# EAGLE schematic vichaarak (EAGLE 9.6.2)
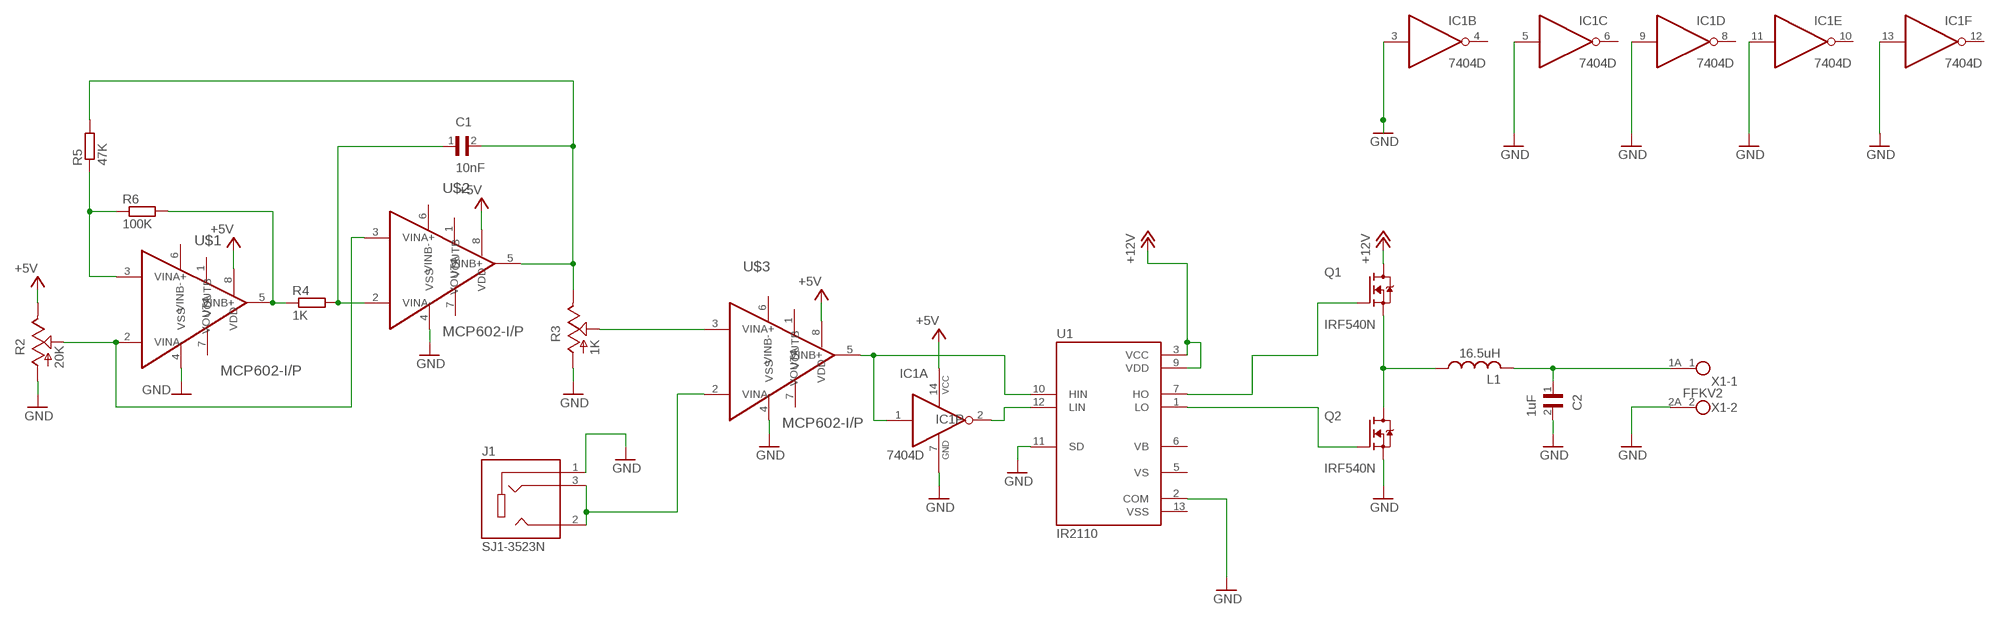
[diagram p0: schematic, sheet 1]

## Parts
C1  10nF  CAPACITOR  [C0603]
C2  1uF  CAPACITOR  [C0603]
IC1  7404D  [SO14]
J1  SJ1-3523N  [CUI_SJ1-3523N]
L1  16.5uH  L-US0204/7  [0204/7]
Q1  IRF540N  [TO254P1054X469X1930-3]
Q2  IRF540N  [TO254P1054X469X1930-3]
R2  20K  TRIM_US-PT10  [PT-10]
R3  1K  TRIM_US-PT10  [PT-10]
R4  1K  RESISTOR  [R0603]
R5  47K  RESISTOR  [R0603]
R6  100K  RESISTOR  [R0603]
U1  IR2110  [DIP762W45P254L2019H533Q14]
U$1  MCP602-I/P  [DIP787W46P254L927H533Q8]
U$2  MCP602-I/P  [DIP787W46P254L927H533Q8]
U$3  MCP602-I/P  [DIP787W46P254L927H533Q8]
X1  FFKV2  [FFKV2]

## Nets
+5V: IC1.14(P:VCC) R2.E U$1.8(VDD) U$2.8(VDD) U$3.8(VDD)
+12V: Q1.2(D) U1.3(VCC) U1.9(VDD)
GND: C2.2 IC1.3(B:I) IC1.5(C:I) IC1.7(P:GND) IC1.9(D:I) IC1.11(E:I) IC1.13(F:I) J1.1 Q2.3(S) R2.A R3.A U1.2(COM) U1.11(SD) U$1.4(VSS) U$2.4(VSS) U$3.4(VSS) X1.2A
N$1: R2.S U$1.2(VINA-) U$2.3(VINA+)
N$2: R5.1 R6.1 U$1.3(VINA+)
N$3: C1.2 R3.E R5.2 U$2.5(VINB+)
N$4: R4.1 R6.2 U$1.5(VINB+)
N$5: C1.1 R4.2 U$2.2(VINA-)
N$7: R3.S U$3.3(VINA+)
N$8: J1.2 J1.3 U$3.2(VINA-)
N$9: IC1.2(A:O) U1.12(LIN)
N$10: IC1.1(A:I) U1.10(HIN) U$3.5(VINB+)
N$11: L1.1 Q1.3(S) Q2.2(D)
N$12: Q1.1(G) U1.7(HO)
N$13: Q2.1(G) U1.1(LO)
N$14: C2.1 L1.2 X1.1A
Unconnected: IC1.4(B:O) IC1.6(C:O) IC1.8(D:O) IC1.10(E:O) IC1.12(F:O) U1.5(VS) U1.6(VB) U$1.1(VOUTA) U$1.6(VINB-) U$1.7(VOUTB) U$2.1(VOUTA) U$2.6(VINB-) U$2.7(VOUTB) U$3.1(VOUTA) U$3.6(VINB-) U$3.7(VOUTB) X1.1 X1.2

## Power pins joined to a net without a drawn wire
VSS: U1.13(VSS)

## Library data of the parts
C1 C2 = PC_Capacitor_0603:CAPACITOR: CAP CERAMIC, 0.1UF, 50V, X7R, 0603, FULL REEL Check prices <https://pricing.snapeda.com/parts/CGA3E2X7R1H104K080AA/TDK/view-part?ref=eda>; AVAILABILITY: Good; DESCRIPTION: 0.1µF ±10% 50V Ceramic Capacitor X7R 0603 (1608 Metric); MF: TDK; MP: CGA3E2X7R1H104K080AA; PACKAGE: 1608 TDK; PRICE: None; PURCHASE-URL: https://pricing.snapeda.com/search/part/CGA3E2X7R1H104K080AA/?ref=eda
IC1 = 74xx-us:74*04: Hex INVERTER
J1 = SJ1-3523N:SJ1-3523N: Check availability <https://pricing.snapeda.com/parts/SJ1-3523N/Same%20Sky/view-part?ref=eda>; AVAILABILITY: In Stock; CHECK_PRICES: https://www.snapeda.com/parts/SJ1-3523N/Same+Sky/view-part/?ref=eda; DESCRIPTION: 3.5 mm, Stereo, Right Angle, Through Hole, 3 Conductors, 0 Internal Switches, Audio Jack Connector; MF: Same Sky; MP: SJ1-3523N; PACKAGE: None; PRICE: None; SNAPEDA_LINK: https://www.snapeda.com/parts/SJ1-3523N/Same+Sky/view-part/?ref=snap
L1 = rcl:L-US: INDUCTOR, American symbol; SPICEPREFIX: L
Q1 Q2 = IRF540N:IRF540N: Check availability <https://pricing.snapeda.com/parts/IRF540N/Infineon%20Technologies/view-part?ref=eda>; AVAILABILITY: In Stock; CHECK_PRICES: https://www.snapeda.com/parts/IRF540N/Infineon/view-part/?ref=eda; DESCRIPTION: Transistor NPN MOS IRF540/IRF540N INTERNATIONAL RECTIFIER Ampere=28 V=100 TO220; MF: Infineon Technologies; MP: IRF540N; PACKAGE: Package; PRICE: None; SNAPEDA_LINK: https://www.snapeda.com/parts/IRF540N/Infineon/view-part/?ref=snap
R2 R3 = pot:TRIM_US-: POTENTIOMETER
R4-R6 = PC_Resistor_0603:RESISTOR; MF: Yageo; RESISTOR: 0603
U1 = IR2110:IR2110: Check availability <https://pricing.snapeda.com/parts/IR2110/Infineon/view-part?ref=eda>; AVAILABILITY: In Stock; CHECK_PRICES: https://www.snapeda.com/parts/IR2110/Infineon/view-part/?ref=eda; DESCRIPTION: Half-Bridge Gate Driver IC Non-Inverting 14-PDIP; MF: Infineon; MP: IR2110; PACKAGE: DIP-14 International Rectifier; PRICE: None; SNAPEDA_LINK: https://www.snapeda.com/parts/IR2110/Infineon/view-part/?ref=snap
U$1-U$3 = MCP602-I_P:MCP602-I/P: Check availability <https://pricing.snapeda.com/parts/MCP602-I/P/Microchip%20Technology/view-part?ref=eda>; AVAILABILITY: In Stock; CHECK_PRICES: https://www.snapeda.com/parts/MCP602-I/P/Microchip+Technology/view-part/?ref=eda; DESCRIPTION: Microchip MCP602-I/P,Dual Op Amp,2.8MHz CMOS,Rail to Rail,3V,5V,8-Pin PDIP | Microchip Technology Inc. MCP602-I/P; MF: Microchip Technology; MP: MCP602-I/P; PACKAGE: DIP-8 Microchip; PRICE: None; SNAPEDA_LINK: https://www.snapeda.com/parts/MCP602-I/P/Microchip+Technology/view-part/?ref=snap
X1 = con-phoenix-508:FFKV2: PHOENIX; OC_FARNELL: unknown; OC_NEWARK: unknown